# Altium schematic sheet Relay_top.SchDoc: DCAR
size A4; DocumentNumber: 1; SheetNumber: 1; SheetTotal: 5
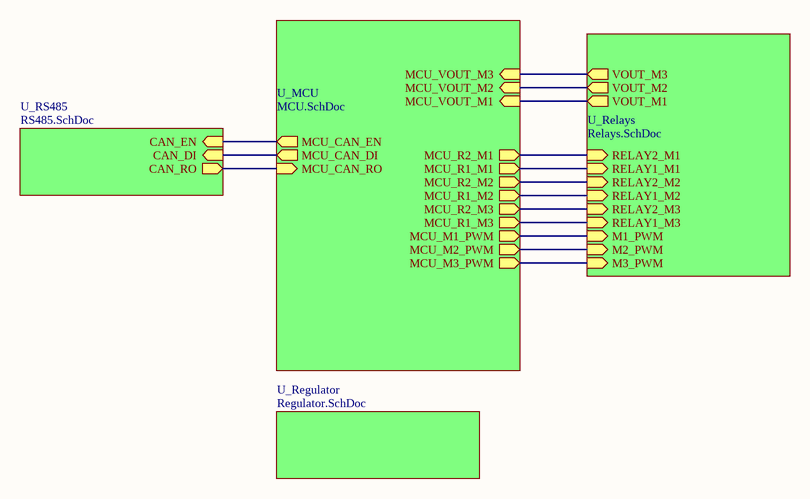
[diagram p0: Relay_top.SchDoc]

## Sub-sheets
U_MCU = MCU.SchDoc: MCU_VOUT_M3 (in), MCU_VOUT_M1 (in), MCU_VOUT_M2 (in), MCU_CAN_RO (in), MCU_CAN_DI (out), MCU_CAN_EN (out), MCU_R2_M1 (out), MCU_R1_M1 (out), MCU_R2_M2 (out), MCU_R1_M2 (out), MCU_R2_M3 (out), MCU_R1_M3 (out), MCU_M1_PWM (out), MCU_M2_PWM (out), MCU_M3_PWM (out)
U_Regulator = Regulator.SchDoc: no entries
U_Relays = Relays.SchDoc: VOUT_M1 (out), VOUT_M3 (out), VOUT_M2 (out), RELAY2_M1 (in), RELAY1_M1 (in), RELAY2_M2 (in), RELAY1_M2 (in), RELAY2_M3 (in), RELAY1_M3 (in), M1_PWM (in), M2_PWM (in), M3_PWM (in)
U_RS485 = RS485.SchDoc: CAN_RO (out), CAN_EN (in), CAN_DI (in)

## Nets
(unnamed): sheet U_MCU/MCU_VOUT_M3, sheet U_Relays/VOUT_M3
(unnamed): sheet U_MCU/MCU_VOUT_M1, sheet U_Relays/VOUT_M1
(unnamed): sheet U_MCU/MCU_VOUT_M2, sheet U_Relays/VOUT_M2
(unnamed): sheet U_MCU/MCU_CAN_RO, sheet U_RS485/CAN_RO
(unnamed): sheet U_MCU/MCU_CAN_DI, sheet U_RS485/CAN_DI
(unnamed): sheet U_MCU/MCU_CAN_EN, sheet U_RS485/CAN_EN
(unnamed): sheet U_MCU/MCU_R2_M1, sheet U_Relays/RELAY2_M1
(unnamed): sheet U_MCU/MCU_R1_M1, sheet U_Relays/RELAY1_M1
(unnamed): sheet U_MCU/MCU_R2_M2, sheet U_Relays/RELAY2_M2
(unnamed): sheet U_MCU/MCU_R1_M2, sheet U_Relays/RELAY1_M2
(unnamed): sheet U_MCU/MCU_R2_M3, sheet U_Relays/RELAY2_M3
(unnamed): sheet U_MCU/MCU_R1_M3, sheet U_Relays/RELAY1_M3
(unnamed): sheet U_MCU/MCU_M1_PWM, sheet U_Relays/M1_PWM
(unnamed): sheet U_MCU/MCU_M2_PWM, sheet U_Relays/M2_PWM
(unnamed): sheet U_MCU/MCU_M3_PWM, sheet U_Relays/M3_PWM

## Notes on the sheet
- Title
- Size:
- Date:
- A4
- Number:
- Time:
- Revision:
- Sheet
- of
- NPN
- Lab
- File: